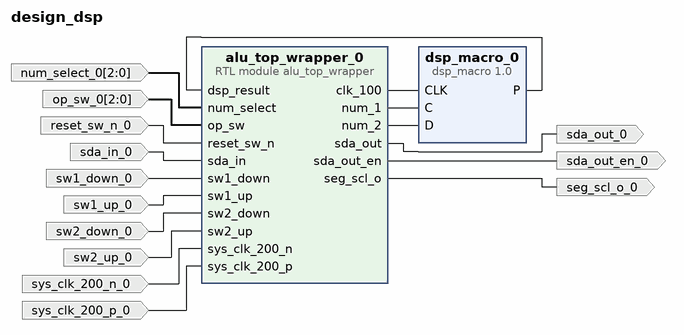
[diagram p0: block diagram of the top level]
# Vivado block design design_dsp, xc7a35tfgg484-2, Vivado 2025.1
create_bd_design design_dsp

create_bd_port -dir I -from 2 -to 0 num_select_0
create_bd_port -dir I -from 2 -to 0 op_sw_0
create_bd_port -dir I -type rst reset_sw_n_0
create_bd_port -dir I sda_in_0
create_bd_port -dir O sda_out_0
create_bd_port -dir O sda_out_en_0
create_bd_port -dir O seg_scl_o_0
create_bd_port -dir I sw1_down_0
create_bd_port -dir I sw1_up_0
create_bd_port -dir I sw2_down_0
create_bd_port -dir I sw2_up_0
create_bd_port -dir I sys_clk_200_n_0
create_bd_port -dir I sys_clk_200_p_0

create_bd_cell -type module -reference alu_top_wrapper alu_top_wrapper_0
create_bd_cell -type ip -vlnv xilinx.com:ip:dsp_macro:1.0 dsp_macro_0
set_property -dict [list \
  CONFIG.a_width 8 \
  CONFIG.areg_1 false \
  CONFIG.areg_2 false \
  CONFIG.areg_3 false \
  CONFIG.areg_4 false \
  CONFIG.breg_3 false \
  CONFIG.breg_4 false \
  CONFIG.c_width 8 \
  CONFIG.creg_1 true \
  CONFIG.creg_3 false \
  CONFIG.creg_4 false \
  CONFIG.creg_5 false \
  CONFIG.d_width 8 \
  CONFIG.dreg_1 true \
  CONFIG.dreg_2 false \
  CONFIG.dreg_3 false \
  CONFIG.instruction1 D+C \
  CONFIG.mreg_5 false \
  CONFIG.output_properties User_Defined \
  CONFIG.p_binarywidth 16 \
  CONFIG.p_full_width 9 \
  CONFIG.p_width 16 \
  CONFIG.pipeline_options Expert \
  CONFIG.preg_6 true \
] [get_bd_cells dsp_macro_0]

# ---- connections ----

connect_bd_net [get_bd_pins alu_top_wrapper_0/clk_100] [get_bd_pins dsp_macro_0/CLK]
connect_bd_net [get_bd_pins alu_top_wrapper_0/num_1] [get_bd_pins dsp_macro_0/C]
connect_bd_net [get_bd_pins alu_top_wrapper_0/num_2] [get_bd_pins dsp_macro_0/D]
connect_bd_net [get_bd_pins alu_top_wrapper_0/sda_out] [get_bd_ports sda_out_0]
connect_bd_net [get_bd_pins alu_top_wrapper_0/sda_out_en] [get_bd_ports sda_out_en_0]
connect_bd_net [get_bd_pins alu_top_wrapper_0/seg_scl_o] [get_bd_ports seg_scl_o_0]
connect_bd_net [get_bd_pins dsp_macro_0/P] [get_bd_pins alu_top_wrapper_0/dsp_result]
connect_bd_net -net num_select_0_1 [get_bd_ports num_select_0] [get_bd_pins alu_top_wrapper_0/num_select]
connect_bd_net -net op_sw_0_1 [get_bd_ports op_sw_0] [get_bd_pins alu_top_wrapper_0/op_sw]
connect_bd_net -net reset_sw_n_0_1 [get_bd_ports reset_sw_n_0] [get_bd_pins alu_top_wrapper_0/reset_sw_n]
connect_bd_net -net sda_in_0_1 [get_bd_ports sda_in_0] [get_bd_pins alu_top_wrapper_0/sda_in]
connect_bd_net -net sw1_down_0_1 [get_bd_ports sw1_down_0] [get_bd_pins alu_top_wrapper_0/sw1_down]
connect_bd_net -net sw1_up_0_1 [get_bd_ports sw1_up_0] [get_bd_pins alu_top_wrapper_0/sw1_up]
connect_bd_net -net sw2_down_0_1 [get_bd_ports sw2_down_0] [get_bd_pins alu_top_wrapper_0/sw2_down]
connect_bd_net -net sw2_up_0_1 [get_bd_ports sw2_up_0] [get_bd_pins alu_top_wrapper_0/sw2_up]
connect_bd_net -net sys_clk_200_n_0_1 [get_bd_ports sys_clk_200_n_0] [get_bd_pins alu_top_wrapper_0/sys_clk_200_n]
connect_bd_net -net sys_clk_200_p_0_1 [get_bd_ports sys_clk_200_p_0] [get_bd_pins alu_top_wrapper_0/sys_clk_200_p]

validate_bd_design
save_bd_design
